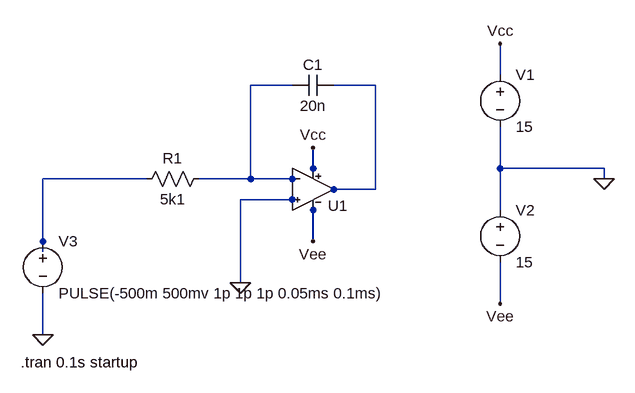
[diagram p0: schematic Integrador.asc]
Integrador.asc, the LTspice schematic file:
Version 4
SHEET 1 880 680
WIRE 576 16 576 -32
WIRE 256 32 192 32
WIRE 384 32 320 32
WIRE 288 160 288 128
WIRE 576 160 576 96
WIRE 736 160 576 160
WIRE 32 176 -128 176
WIRE 192 176 192 32
WIRE 192 176 112 176
WIRE 256 176 192 176
WIRE 736 176 736 160
WIRE 384 192 384 32
WIRE 384 192 320 192
WIRE 256 208 176 208
WIRE 576 224 576 160
WIRE -128 272 -128 176
WIRE 288 272 288 224
WIRE -128 288 -128 272
WIRE 176 336 176 208
WIRE 576 368 576 304
WIRE -128 416 -128 352
FLAG -128 416 0
FLAG 736 176 0
FLAG 176 336 0
FLAG 576 -32 Vcc
FLAG 288 128 Vcc
FLAG 576 368 Vee
FLAG 288 272 Vee
SYMBOL res 128 160 R90
WINDOW 0 0 56 VBottom 2
WINDOW 3 32 56 VTop 2
SYMATTR InstName R1
SYMATTR Value 5k1
SYMBOL cap 320 16 R90
WINDOW 0 0 32 VBottom 2
WINDOW 3 32 32 VTop 2
SYMATTR InstName C1
SYMATTR Value 20n
SYMBOL voltage 576 0 R0
WINDOW 123 0 0 Left 0
WINDOW 39 0 0 Left 0
SYMATTR InstName V1
SYMATTR Value 15
SYMBOL voltage 576 208 R0
WINDOW 123 0 0 Left 0
WINDOW 39 0 0 Left 0
SYMATTR InstName V2
SYMATTR Value 15
SYMBOL voltage -128 256 R0
WINDOW 123 0 0 Left 0
WINDOW 39 0 0 Left 0
SYMATTR InstName V3
SYMATTR Value PULSE(-500m 500mv 1p 1p 1p 0.05ms 0.1ms)
SYMBOL Germosymb\\LM833 288 192 R0
SYMATTR InstName U1
TEXT -162 458 Left 2 !.tran 0.1s startup

The netlist it stands for:
* Integrador.asc
R1 N001 N003 5k1
C1 N002 N001 20n
V1 Vcc 0 15
V2 0 Vee 15
V3 N003 0 PULSE(-500m 500mv 1p 1p 1p 0.05ms 0.1ms)
XU1 0 0 N001 N001 Vcc Vcc Vee Vee N002 N002 LM833 LM833 Avol=316.2K GBW=15Meg Slew=5Meg ilimit=25m rail=0 Vos=0 phimargin=60 en=0 enk=0 in=0 ink=0 Rin=175K  ; pins In+ In+ In- In- V+ V+ V- V- OUT OUT
.tran 0.1s startup
.lib nico/LM833.sub
.backanno
.end

* Results of the author's LTspice run, read from the files saved beside the schematic
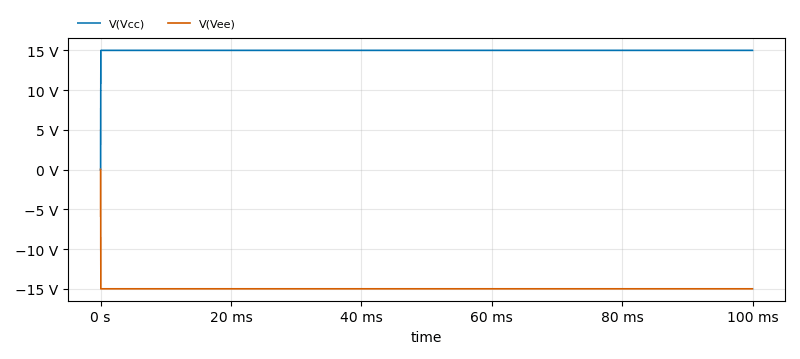
[diagram p1: Transient Analysis of Integrador.asc, plotted from the saved traces]
* Transient Analysis, 1 run:
*   V(Vcc): min 0 V, max 15 V, average 15 V, rms 15 V, last 15 V
*   V(Vee): min -15 V, max 0 V, average -15 V, rms 15 V, last -15 V